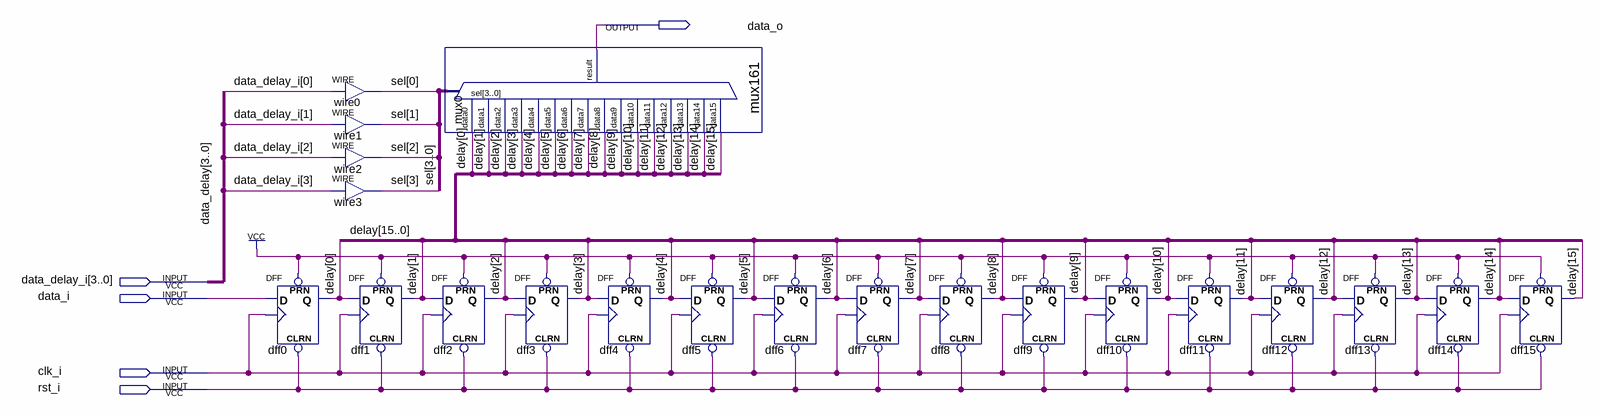
[diagram p0: schematic sheet]
// Quartus schematic delay_15_top.bdf as structural Verilog: 21 symbols, 5 pins
module delay_15_top (
  input  [3:0] data_delay_i,
  input  data_i,
  input  clk_i,
  input  rst_i,
  output data_o
);

  wire [3:0] sel;
  wire [15:0] delay;

  DFF dff0 (.CLRN(rst_i), .CLK(clk_i), .D(data_i), .PRN(1'b1), .Q(delay[0]));
  assign sel[0] = data_delay_i[0];  // WIRE wire0
  assign sel[1] = data_delay_i[1];  // WIRE wire1
  assign sel[2] = data_delay_i[2];  // WIRE wire2
  assign sel[3] = data_delay_i[3];  // WIRE wire3
  DFF dff1 (.CLRN(rst_i), .CLK(clk_i), .D(delay[0]), .PRN(1'b1), .Q(delay[1]));
  mux161 mux0 (
    .data15(delay[15]), .data14(delay[14]), .data13(delay[13]), .data12(delay[12]), .data11(delay[11]),
    .data10(delay[10]), .data9(delay[9]), .data8(delay[8]), .data7(delay[7]), .data6(delay[6]),
    .data5(delay[5]), .data4(delay[4]), .data3(delay[3]), .data2(delay[2]), .data1(delay[1]),
    .data0(delay[0]), .sel(sel), .result(data_o));
  DFF dff2 (.CLRN(rst_i), .CLK(clk_i), .D(delay[1]), .PRN(1'b1), .Q(delay[2]));
  DFF dff3 (.CLRN(rst_i), .CLK(clk_i), .D(delay[2]), .PRN(1'b1), .Q(delay[3]));
  DFF dff4 (.CLRN(rst_i), .CLK(clk_i), .D(delay[3]), .PRN(1'b1), .Q(delay[4]));
  DFF dff5 (.CLRN(rst_i), .CLK(clk_i), .D(delay[4]), .PRN(1'b1), .Q(delay[5]));
  DFF dff6 (.CLRN(rst_i), .CLK(clk_i), .D(delay[5]), .PRN(1'b1), .Q(delay[6]));
  DFF dff7 (.CLRN(rst_i), .CLK(clk_i), .D(delay[6]), .PRN(1'b1), .Q(delay[7]));
  DFF dff8 (.CLRN(rst_i), .CLK(clk_i), .D(delay[7]), .PRN(1'b1), .Q(delay[8]));
  DFF dff9 (.CLRN(rst_i), .CLK(clk_i), .D(delay[8]), .PRN(1'b1), .Q(delay[9]));
  DFF dff10 (.CLRN(rst_i), .CLK(clk_i), .D(delay[9]), .PRN(1'b1), .Q(delay[10]));
  DFF dff11 (.CLRN(rst_i), .CLK(clk_i), .D(delay[10]), .PRN(1'b1), .Q(delay[11]));
  DFF dff12 (.CLRN(rst_i), .CLK(clk_i), .D(delay[11]), .PRN(1'b1), .Q(delay[12]));
  DFF dff13 (.CLRN(rst_i), .CLK(clk_i), .D(delay[12]), .PRN(1'b1), .Q(delay[13]));
  DFF dff14 (.CLRN(rst_i), .CLK(clk_i), .D(delay[13]), .PRN(1'b1), .Q(delay[14]));
  DFF dff15 (.CLRN(rst_i), .CLK(clk_i), .D(delay[14]), .PRN(1'b1), .Q(delay[15]));

  // Other names for the same wires on the sheet: data_delay[3:0] = data_delay_i
endmodule
